# EAGLE design Raspberry_output_for_DC_slave_v2_multi (EAGLE 5.10)
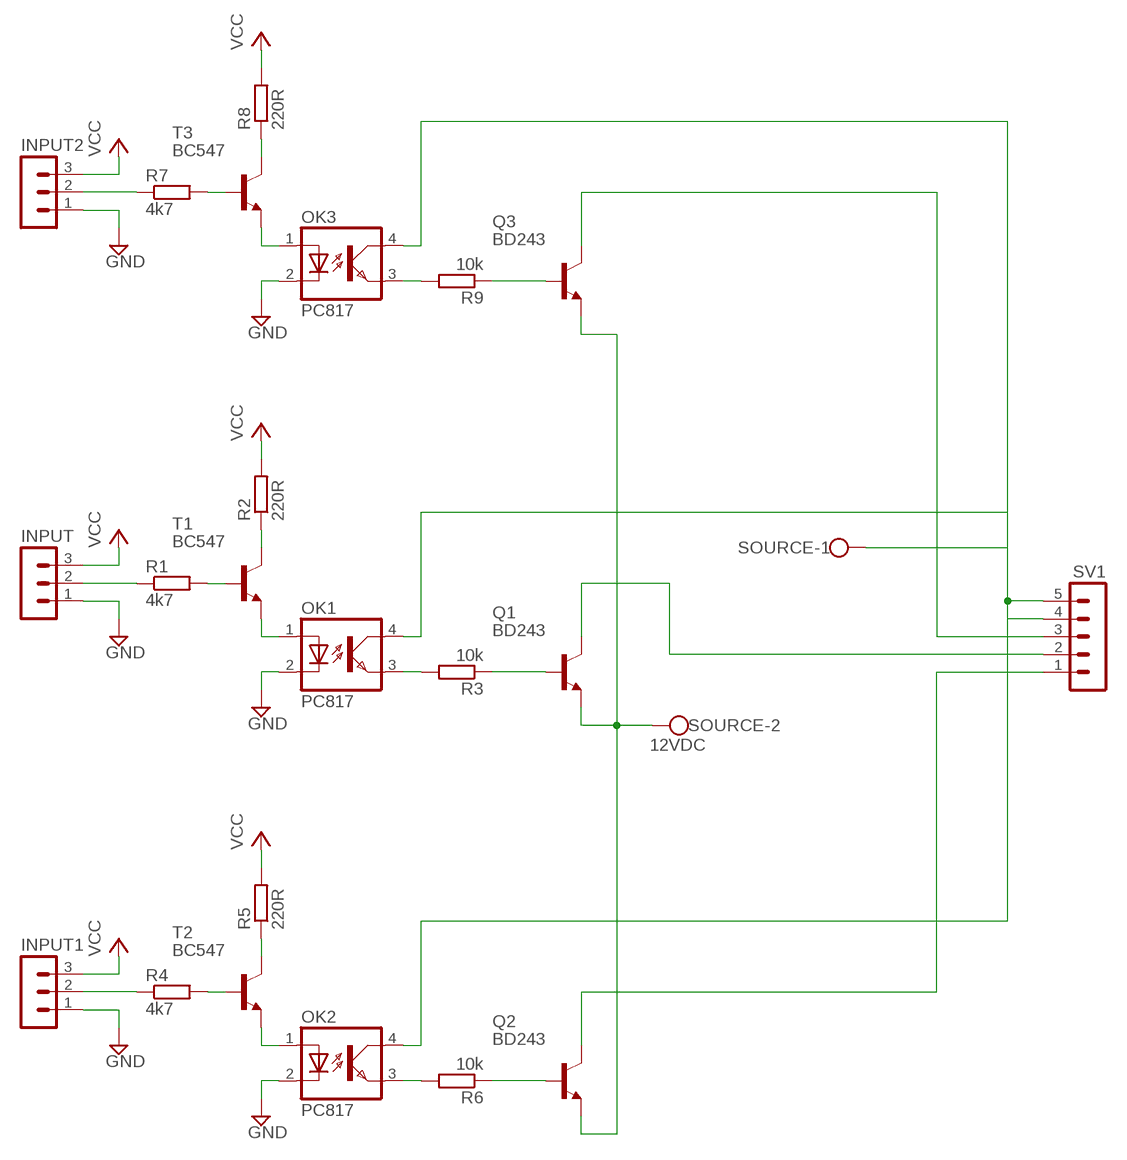
[diagram p0: schematic, sheet 1]

## Parts
INPUT  MA03-1  [MA03-1]
INPUT1  MA03-1  [MA03-1]
INPUT2  MA03-1  [MA03-1]
OK1  PC817  [DIL04]
OK2  PC817  [DIL04]
OK3  PC817  [DIL04]
Q1  BD243  [TO220]
Q2  BD243  [TO220]
Q3  BD243  [TO220]
R1  4k7  R-EU_0207/10  [0207/10]
R2  220R  R-EU_0207/10  [0207/10]
R3  10k  R-EU_0207/10  [0207/10]
R4  4k7  R-EU_0207/10  [0207/10]
R5  220R  R-EU_0207/10  [0207/10]
R6  10k  R-EU_0207/10  [0207/10]
R7  4k7  R-EU_0207/10  [0207/10]
R8  220R  R-EU_0207/10  [0207/10]
R9  10k  R-EU_0207/10  [0207/10]
SOURCE  12VDC  W237-102  [W237-102]
SV1  MA05-1  [MA05-1]
T1  BC547  [TO92]
T2  BC547  [TO92]
T3  BC547  [TO92]

## Nets
GND: INPUT1.1 INPUT2.1 INPUT.1 OK1.2(C) OK2.2(C) OK3.2(C)
INPUT: INPUT.2 R1.1
INPUT1: INPUT1.2 R4.1
INPUT2: INPUT2.2 R7.1
INPUT_REGULATED_CURR_2_BASE: R1.2 T1.2(B)
INPUT_REGULATED_CURR_2_BASE1: R4.2 T2.2(B)
INPUT_REGULATED_CURR_2_BASE2: R7.2 T3.2(B)
N$1: R5.1 T2.3(C)
N$2: R2.1 T1.3(C)
N$3: R8.1 T3.3(C)
OPTO_IN: OK1.1(A) T1.1(E)
OPTO_IN1: OK2.1(A) T2.1(E)
OPTO_IN2: OK3.1(A) T3.1(E)
OPTO_OUT_2_TR: OK1.3(EMIT) R3.2
OPTO_OUT_2_TR1: OK2.3(EMIT) R6.2
OPTO_OUT_2_TR2: OK3.3(EMIT) R9.2
OUTPUT_N: Q1.2(C) SV1.2
OUTPUT_N1: Q2.2(C) SV1.1
OUTPUT_N2: Q3.2(C) SV1.3
SOURCE_N_0V: Q1.3(E) Q2.3(E) Q3.3(E) SOURCE.2
SOURCE_P_12V: OK1.4(COL) OK2.4(COL) OK3.4(COL) SOURCE.1 SV1.4 SV1.5
TR_OUTPUT_BASE: Q1.1(B) R3.1
TR_OUTPUT_BASE1: Q2.1(B) R6.1
TR_OUTPUT_BASE2: Q3.1(B) R9.1
VCC: INPUT1.3 INPUT2.3 INPUT.3 R2.2 R5.2 R8.2

## Library data of the parts
INPUT INPUT1 INPUT2 = con-lstb:MA03-1: PIN HEADER
OK1-OK3 = optocoupler:PC817: SHARP OPTO COUPLER
Q1-Q3 = transistor-npn:BD243*: NPN Transistor
R1-R9 = rcl:R-EU_: RESISTOR, European symbol
SOURCE = con-wago-500:W237-102: WAGO SCREW CLAMP
SV1 = con-lstb:MA05-1: PIN HEADER
T1-T3 = transistor-neu-to92:BC547: NPN TRANSISTOR

## Board
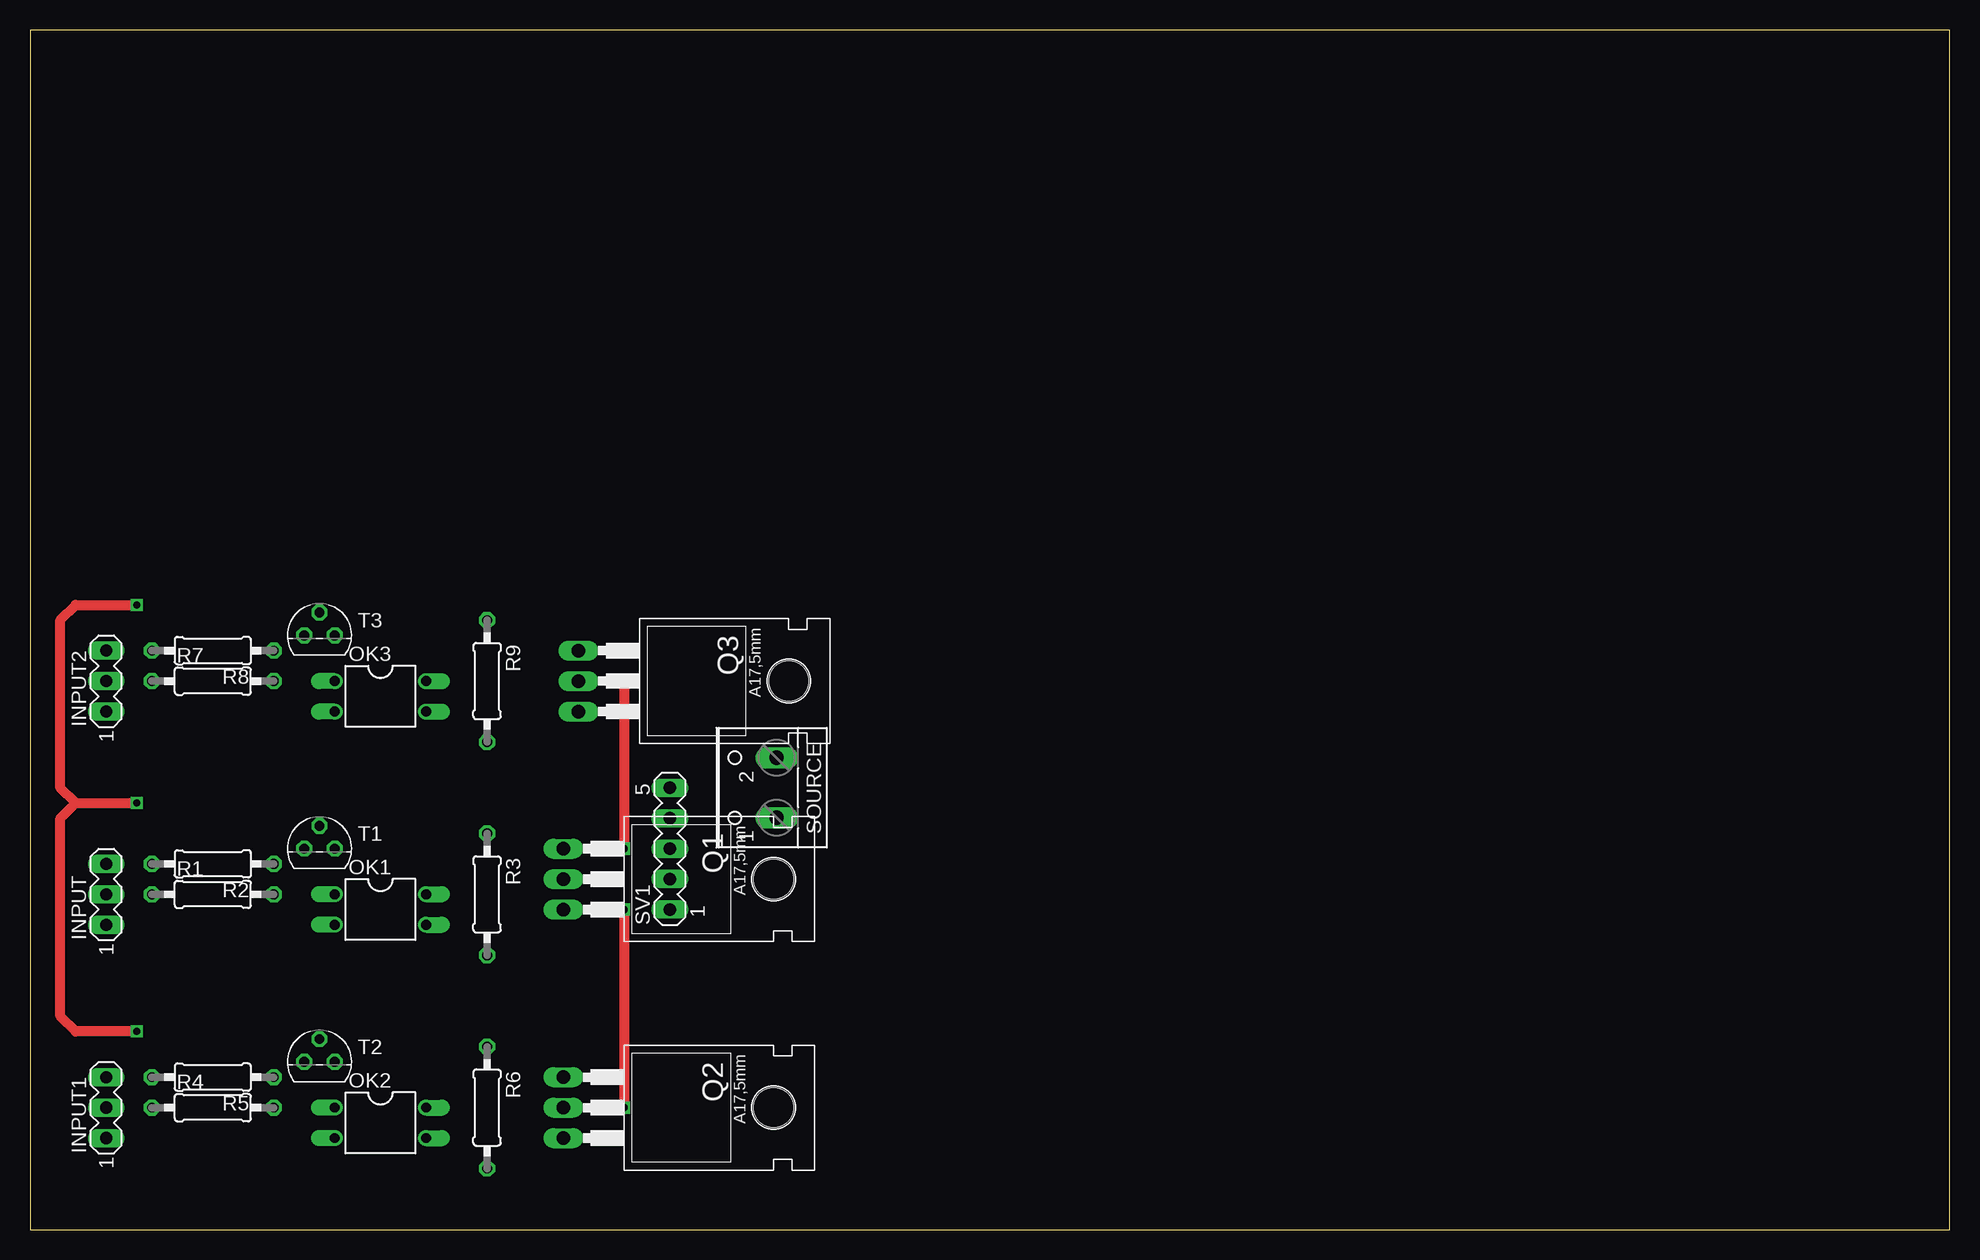
[diagram p1: board, top side]
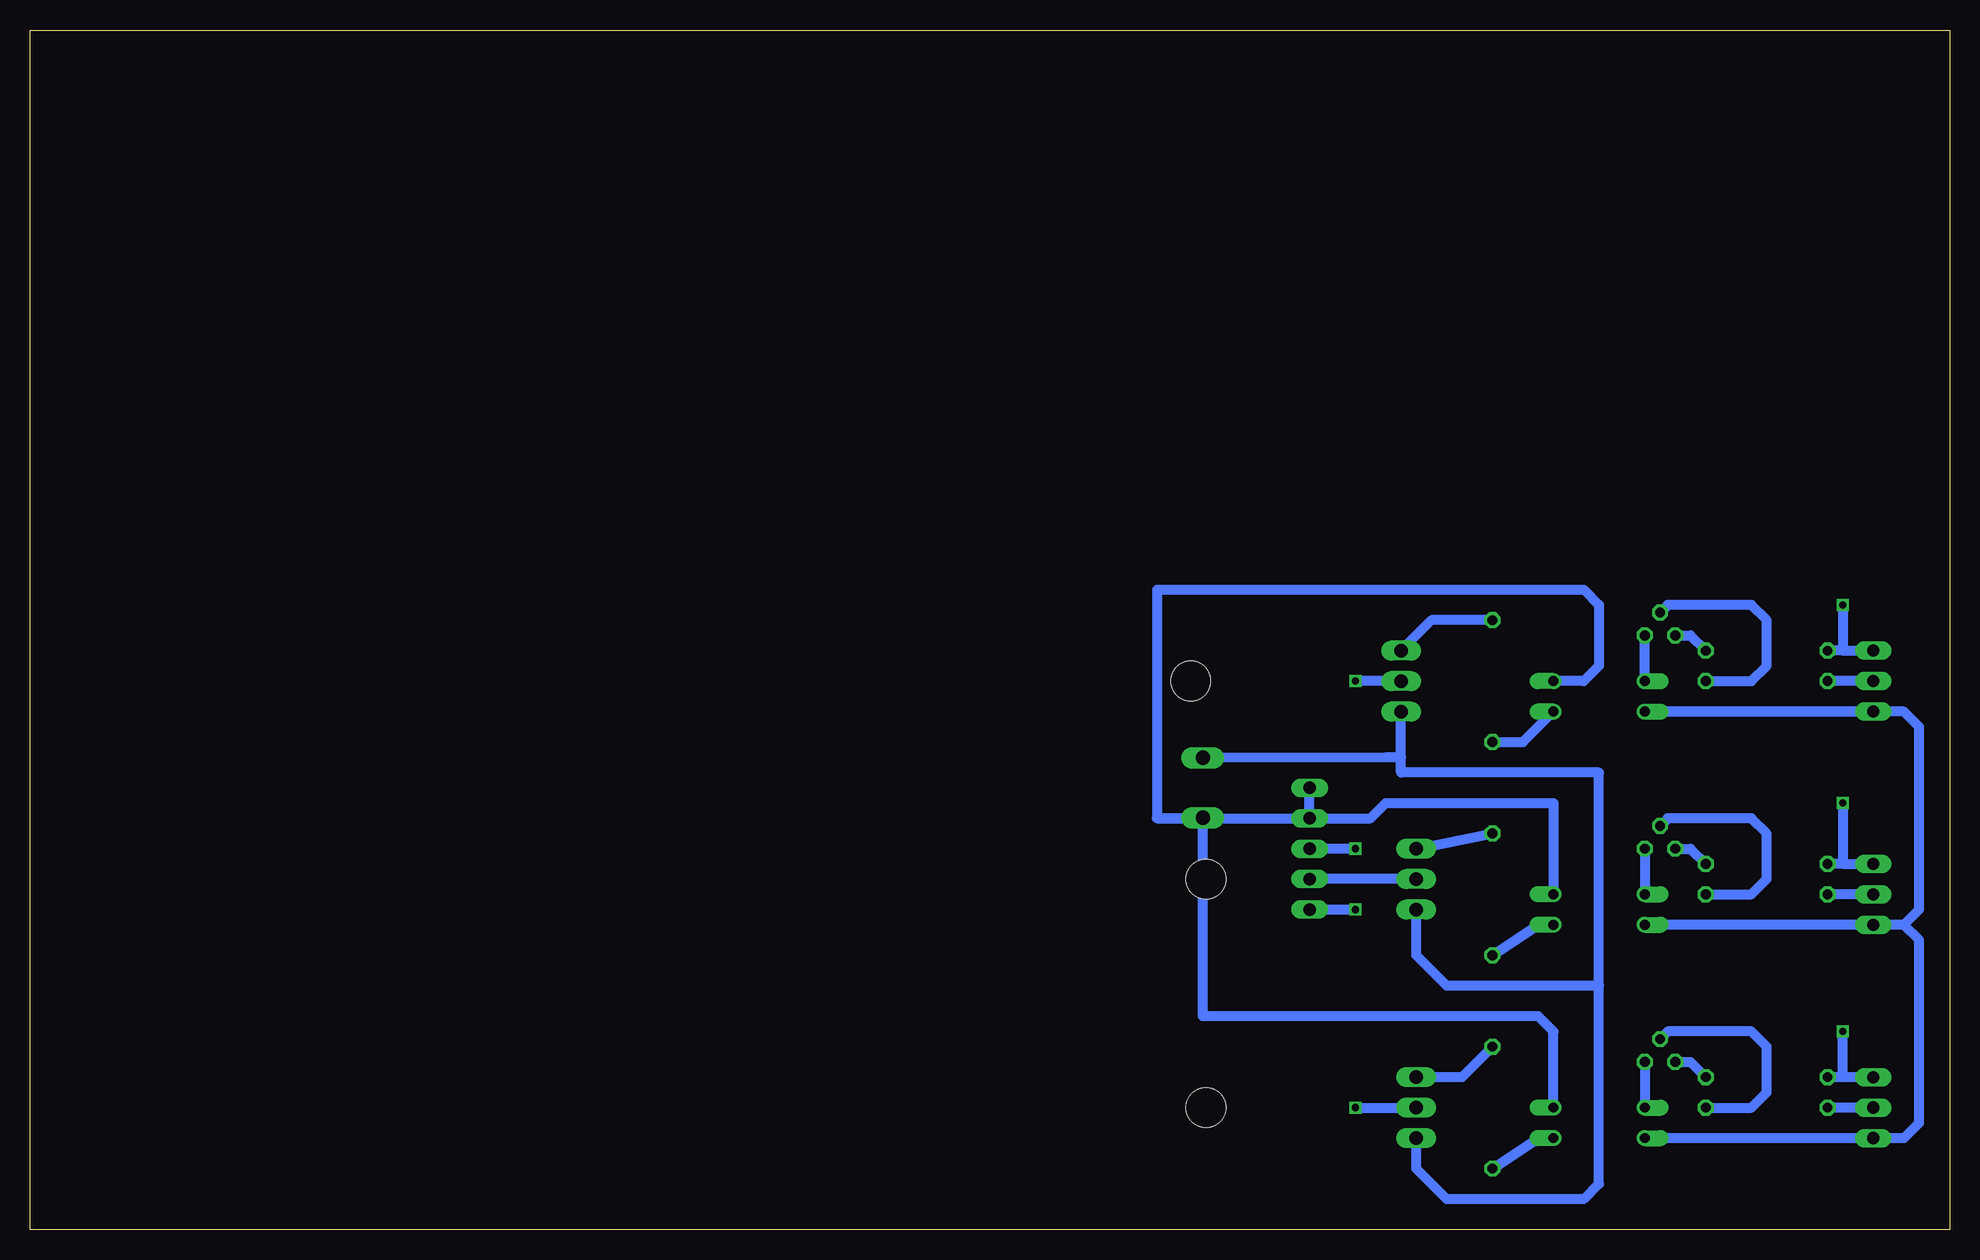
[diagram p2: board, bottom side, seen from below]

Size 160 x 100 mm. Coordinates in mm from the lower left corner, seen from the top.
Outline: 0,0 160,0 160,100 0,100 0,0
Copper layers (1*16): Top 0.035mm / dielectric 1.5mm / Bottom 0.035mm
Design rules "default": minimum track width 10mil, minimum drill 24mil, track to track 8mil, track to pad 8mil, pad to pad 8mil, via to via 8mil, smd to smd 8mil, copper to edge 40mil, drill to drill 8mil, minimum pad ring 10mil, minimum via ring 8mil, stop-mask expansion 4mil, vias tented up to drill 0mil, thermal gap 10mil

### Footprints (pad centres in the part's own frame; a part is rotated, then mirrored left to right if it is on the bottom)
MA03-1 = drill 1.016 long: 1 -2.54,0; 2 0,0; 3 2.54,0
DIL04 = drill 0.813 offset: 1 -1.27,-3.81; 2 1.27,-3.81; 3 1.27,3.81; 4 -1.27,3.81
TO220 = drill 1.118 long: 1 -2.54,-6.35; 2 0,-6.35; 3 2.54,-6.35 | hole 3.302: 0,11.176
0207/10 = drill 0.813 octagon: 1 -5.08,0; 2 5.08,0
W237-102 = drill 1.194 long: 1 -2.5,-1.27; 2 2.5,-1.27
MA05-1 = drill 1.016 long: 1 -5.08,0; 2 -2.54,0; 3 0,0; 4 2.54,0; 5 5.08,0
TO92 = drill 0.813 octagon: 1 1.27,0; 2 0,1.905; 3 -1.27,0

### Placement (x,y rotation side)
INPUT  6.35,27.94 90 top
INPUT1  6.35,10.16 90 top
INPUT2  6.35,45.72 90 top
OK1  29.21,26.67 270 top
OK2  29.21,8.89 270 top
OK3  29.21,44.45 270 top
Q1  50.8,29.21 270 top
Q2  50.8,10.16 270 top
Q3  52.07,45.72 270 top
R1  15.24,27.94 0 top
R2  15.24,30.48 180 top
R3  38.1,27.94 270 top
R4  15.24,10.16 0 top
R5  15.24,12.7 180 top
R6  38.1,10.16 270 top
R7  15.24,45.72 0 top
R8  15.24,48.26 180 top
R9  38.1,45.72 270 top
SOURCE  60.96,36.83 90 top
SV1  53.34,31.75 90 top
T1  24.13,31.75 0 top
T2  24.13,13.97 0 top
T3  24.13,49.53 0 top

### Tracks (layer width: path | path; a pad name or v marks a point on that pad's centre or on a via)
GND
  Bottom 0.813: OK1.2 INPUT.1 3.81,25.4 | OK2.2 INPUT1.1 3.81,7.62 2.54,8.89 2.54,24.13 3.81,25.4 | INPUT2.1 OK3.2 3.81,43.18 2.54,41.91 2.54,26.67 3.81,25.4
INPUT
  Bottom 0.813: INPUT.2 R1.1
INPUT1
  Bottom 0.813: INPUT1.2 R4.1
INPUT2
  Bottom 0.813: INPUT2.2 R7.1
INPUT_REGULATED_CURR_2_BASE
  Bottom 0.813: R1.2 16.51,27.94 15.24,29.21 15.24,33.02 16.51,34.29 23.5,34.29 T1.2
INPUT_REGULATED_CURR_2_BASE1
  Bottom 0.813: R4.2 16.51,10.16 15.24,11.43 15.24,15.24 16.51,16.51 23.5,16.51 T2.2
INPUT_REGULATED_CURR_2_BASE2
  Bottom 0.813: R7.2 16.51,45.72 15.24,46.99 15.24,50.8 16.51,52.07 23.5,52.07 T3.2
N$1
  Bottom 0.813: T2.3 21.59,13.97 R5.1
N$2
  Bottom 0.813: T1.3 21.59,31.75 R2.1
N$3
  Bottom 0.813: T3.3 21.59,49.53 R8.1
OPTO_IN
  Bottom 0.813: T1.1 OK1.1
OPTO_IN1
  Bottom 0.813: T2.1 OK2.1
OPTO_IN2
  Bottom 0.813: OK3.1 T3.1
OPTO_OUT_2_TR
  Bottom 0.813: OK1.3 34.29,25.4 R3.2
OPTO_OUT_2_TR1
  Bottom 0.813: OK2.3 34.29,7.62 R6.2
OPTO_OUT_2_TR2
  Bottom 0.813: R9.2 35.56,40.64 OK3.3
OUTPUT_N
  Bottom 0.813: Q1.2 SV1.2
OUTPUT_N1  (via drill 0.6)
  Top 0.813: v49.53,26.67 v49.53,10.16
  Bottom 0.813: SV1.1 v49.53,26.67 | v49.53,10.16 Q2.2
OUTPUT_N2  (via drill 0.6)
  Top 0.813: v49.53,45.72 v49.53,31.75
  Bottom 0.813: Q3.2 v49.53,45.72 | v49.53,31.75 SV1.3
SOURCE_N_0V
  Bottom 0.813: Q1.3 44.45,22.86 41.91,20.32 29.21,20.32 | 29.21,20.32 29.21,38.1 45.72,38.1 45.72,39.37 | Q2.3 44.45,5.08 41.91,2.54 30.48,2.54 29.21,3.81 29.21,20.32 | 45.72,39.37 Q3.3 | 45.72,39.37 46.95,39.37 SOURCE.2
SOURCE_P_12V
  Bottom 0.813: OK1.4 33.02,35.56 46.99,35.56 48.26,34.29 SV1.4 | SV1.4 SV1.5 | SOURCE.1 62.27,34.33 66.04,34.29 | 66.04,34.29 SV1.4 | OK2.4 33.02,16.51 34.29,17.78 62.23,17.78 SOURCE.1 | OK3.4 30.48,45.72 29.21,46.99 29.21,52.07 30.48,53.34 66.04,53.34 66.04,34.29 | 66.04,34.29 66.08,34.29 SOURCE.1
TR_OUTPUT_BASE
  Bottom 0.813: Q1.1 R3.1
TR_OUTPUT_BASE1
  Bottom 0.813: R6.1 40.64,12.7 Q2.1
TR_OUTPUT_BASE2
  Bottom 0.813: R9.1 43.18,50.8 Q3.1
VCC  (via drill 0.6)
  Top 0.813: v8.89,16.51 3.81,16.51 2.54,17.78 2.54,34.29 3.81,35.56 | 3.81,35.56 v8.89,35.56 | 3.81,35.56 2.54,36.83 2.54,50.8 3.81,52.07 v8.89,52.07
  Bottom 0.813: 8.89,30.48 INPUT.3 | 8.89,30.48 R2.2 | INPUT1.3 8.89,12.7 | 8.89,48.26 INPUT2.3 | 8.89,48.26 R8.2 | 8.89,12.7 R5.2 | 8.89,12.7 v8.89,16.51 | v8.89,35.56 8.89,30.48 | v8.89,52.07 8.89,48.26